# EAGLE design BSK3 (EAGLE 9.4.2)
ESKD_DESCRIPTION1: 207|235|224|242|224|32|193|209|202|51; ESKD_DESCRIPTION2: 241|245|229|236|224|32|253|235|229|234|242|240|232|247|229|241|234|224|255; ESKD_DESCRIPTION3: 239|240|232|237|246|232|239|232|224|235|252|237|224|255; ESKD_NUMBER: 67|67|83|50|46|50|52|48|48|45|48|221|51; ESKD_NUMBER_SHEET: 49; ESKD_SHEETS: 49
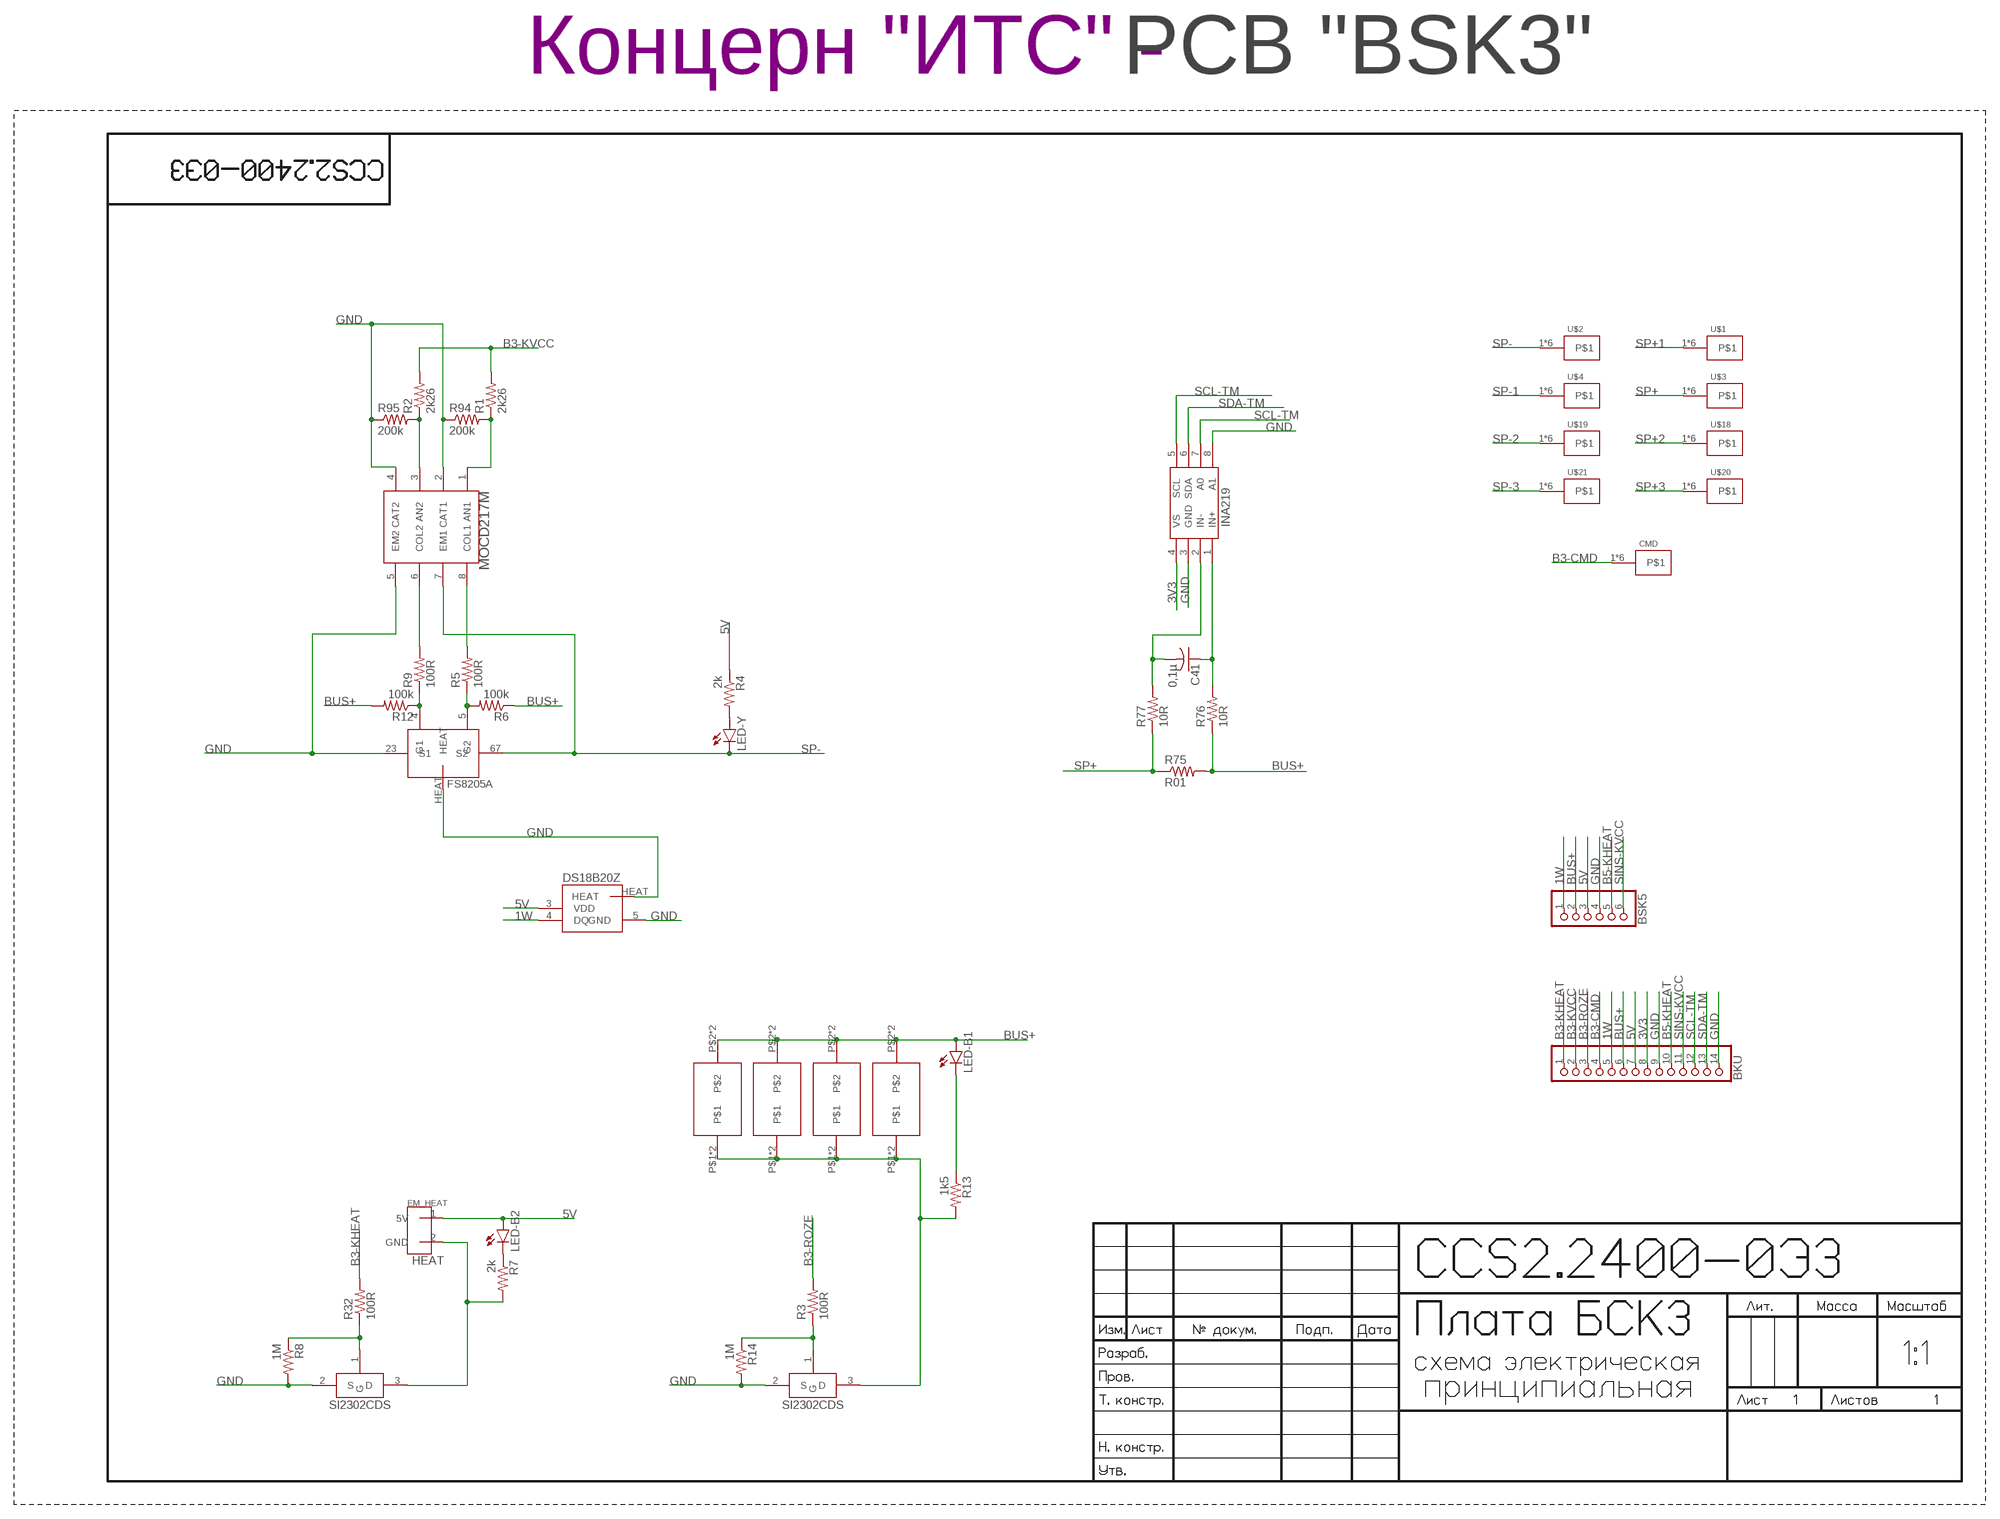
[diagram p0: schematic, sheet 1]

## Parts
BKU  PINHD-1X14  [1X14]
BSK5  PINHD-1X6  [1X06]
C41  0,1µ  C-USC0603  [C0603]
CMD  KCONNECTQUAD  [KCONNECT_QUAD]
DS18B20Z  DS18B20Z  [SOIC8+HEAT_S]
INA  INA219AID  [SOT23-8]
LED-B1  LEDCHIPLED_0603  [CHIPLED_0603]
LED-B2  LEDCHIPLED_0603  [CHIPLED_0603]
LED-Y  LAP4-BOTTOM  [P47F-BOTTOM]
R1  2k26  R-US_R0603  [R0603]
R2  2k26  R-US_R0603  [R0603]
R3  100R  R-US_R0603  [R0603]
R4  2k  R-US_R0603  [R0603]
R5  100R  R-US_R0603  [R0603]
R6  100k  R-US_R0603  [R0603]
R7  2k  R-US_R0603  [R0603]
R8  1M  R-US_R0603  [R0603]
R9  100R  R-US_R0603  [R0603]
R12  100k  R-US_R0603  [R0603]
R13  1k5  R-US_R0603  [R0603]
R14  1M  R-US_R0603  [R0603]
R32  100R  R-US_R0603  [R0603]
R75  R01  R-US_R2512  [R2512]
R76  10R  R-US_R0603  [R0603]
R77  10R  R-US_R0603  [R0603]
R94  200k  R-US_R0603  [R0603]
R95  200k  R-US_R0603  [R0603]
U$1  KCONNECT  [KCONNECT]
U$2  KCONNECT  [KCONNECT]
U$3  KCONNECT  [KCONNECT]
U$4  KCONNECT  [KCONNECT]
U$5  MOCD  MOCD217M  [SOIC8]
U$6  GRAFITGRAFIT4_2  [GRAFIT4_2]
U$7  GRAFITGRAFIT4_2  [GRAFIT4_2]
U$8  SI2302CDS  [SOT23-3]
U$9  PCB "BSK3"  ITS-LOGOPCB-""  [ITS-LOGO]
U$13  SI2302CDS  [SOT23-3]
U$14  EM_HEAT  [EM_HEAT]
U$15  GRAFITGRAFIT4_2  [GRAFIT4_2]
U$16  GRAFITGRAFIT4_2  [GRAFIT4_2]
U$18  KCONNECT  [KCONNECT]
U$19  KCONNECT  [KCONNECT]
U$20  KCONNECT  [KCONNECT]
U$21  KCONNECT  [KCONNECT]
U$26  FS8205A+  [FS8205A+]

## Nets
1: R7.2 U$8.3(D) U$14.2(GND)
1W: BKU.5 BSK5.1 DS18B20Z.4(DQ)
2: R13.2 U$6.P$1 U$6.P$4 U$7.P$1 U$7.P$4 U$13.3(D) U$15.P$1 U$15.P$4 U$16.P$1 U$16.P$4
3V3: BKU.8 INA.4(VS)
5V: BKU.7 BSK5.3 DS18B20Z.3(VDD) LED-B2.A R4.1 U$14.1(5V)
B3-CMD: BKU.4 CMD.1 CMD.2 CMD.3 CMD.4 CMD.P$1 CMD.P$2
B3-KHEAT: BKU.1 R32.2
B3-KVCC: BKU.2 R1.2 R2.2
B3-ROZE: BKU.3 R3.2
B5-KHEAT: BKU.10 BSK5.5
BUS+: BKU.6 BSK5.2 LED-B1.A R6.1 R12.2 R75.2 R76.1 U$6.P$2 U$6.P$5 U$7.P$2 U$7.P$5 U$15.P$2 U$15.P$5 U$16.P$2 U$16.P$5
GND: BKU.9 BKU.14 BSK5.4 DS18B20Z.5(GND) DS18B20Z.HEAT INA.3(GND) INA.8(A1) R8.2 R14.2 R94.1 R95.1 U$5.2(CAT1) U$5.4(CAT2) U$5.5(EM2) U$8.2(S) U$13.2(S) U$26.23(S1) U$26.HEAT
N$1: R5.1 R6.2 U$26.5(G2)
N$2: R1.1 R94.2 U$5.1(AN1)
N$3: R2.1 R95.2 U$5.3(AN2)
N$20: R8.1 R32.1 U$8.1(G)
N$21: R3.1 R14.1 U$13.1(G)
N$27: R9.1 R12.1 U$26.4(G1)
N$28: LED-Y.A R4.2
N$29: LED-B1.C R13.1
N$31: LED-B2.C R7.1
N$150: C41.1 INA.1(IN+) R76.2
N$151: C41.2 INA.2(IN-) R77.2
OC1: R9.2 U$5.6(COL2)
OD1: R5.2 U$5.8(COL1)
SCL-TM: BKU.12 INA.5(SCL) INA.7(A0)
SDA-TM: BKU.13 INA.6(SDA)
SINS-KVCC: BKU.11 BSK5.6
SP+: R75.1 R77.1 U$3.1 U$3.2 U$3.3 U$3.4 U$3.P$1 U$3.P$2
SP+1: U$1.1 U$1.2 U$1.3 U$1.4 U$1.P$1 U$1.P$2
SP+2: U$18.1 U$18.2 U$18.3 U$18.4 U$18.P$1 U$18.P$2
SP+3: U$20.1 U$20.2 U$20.3 U$20.4 U$20.P$1 U$20.P$2
SP-: LED-Y.C U$2.1 U$2.2 U$2.3 U$2.4 U$2.P$1 U$2.P$2 U$5.7(EM1) U$26.67(S2)
SP-1: U$4.1 U$4.2 U$4.3 U$4.4 U$4.P$1 U$4.P$2
SP-2: U$19.1 U$19.2 U$19.3 U$19.4 U$19.P$1 U$19.P$2
SP-3: U$21.1 U$21.2 U$21.3 U$21.4 U$21.P$1 U$21.P$2

## Notes on the sheet
- HEAT

## Library data of the parts
BKU = pinheadCS:PINHD-1X14: PIN HEADER
BSK5 = pinheadCS:PINHD-1X6: PIN HEADER
C41 = rcl:C-US: CAPACITOR, American symbol; SPICEPREFIX: C
CMD U$1-U$4 U$18-U$21 = CanCubeSat:KCONNECT
DS18B20Z = CanCubeSat:DS18B20Z
INA = CanCubeSat:INA219AID
LED-B1 LED-B2 = led:LED: LED OSRAM: - CHIPLED LG R971, LG N971, LY N971, LG Q971, LY Q971, LO R971, LY R971 LH N974, LH R974 LS Q976, LO Q976, LY Q976 LO Q996 - Hyper CHIPLED LW Q18S LB Q993, LB Q99A, LB R99A - SideLED LS A670, LO A670, LY A670, LG A670, LP A670 LB A673, LV A673, LT A673, LW A673 LH A674 LY A675 LS A676, LA A676, LO A676, LY A676, LW A676 LS A679, LY A679, LG A679 - Hyper Micro SIDELED® LS Y876, LA Y876, LO Y876, LY Y876 LT Y87S - SmartLED LW L88C, LW L88S LB L89C, LB L89S, LG L890 LS L89K, LO L89K, LY L89K LS L896, LA L896, LO L896, LY L896 - TOPLED LS T670, LO T670, LY T670, LG T670, LP T670 LSG T670, LSP T670, LSY T670, LOP T670, LYG T670 LG T671, LOG T671, LSG T671 LB T673, LV T673, LT T673, LW T673 LH T674 LS T676, LA T676, LO T676, LY T676, LB T676, LH T676, LSB T676, LW T676 LB T67C, LV T67C, LT T67C, LS T67K, LO T67K, LY T67K, LW E67C LS E67B, LA E67B, LO E67B, LY E67B, LB E67C, LV E67C, LT E67C LW T67C LS T679, LY T679, LG T679 LS T770, LO T770, LY T770, LG T770, LP T770 LB T773, LV T773, LT T773, LW T773 LH T774 LS E675, LA E675, LY E675, LS T675 LS T776, LA T776, LO T776, LY T776, LB T776 LHGB T686 LT T68C, LB T68C - Hyper Mini TOPLED® LB M676 - Mini TOPLED Santana® LG M470 LS M47K, LO M47K, LY M47K Source: http://www.osram.convergy.de LUXEON: - LUMILED® LXK2-PW12-R00, LXK2-PW12-S00, LXK2-PW14-U00, LXK2-PW14-V00 LXK2-PM12-R00, LXK2-PM12-S00, LXK2-PM14-U00 LXK2-PE12-Q00, LXK2-PE12-R00, LXK2-PE12-S00, LXK2-PE14-T00, LXK2-PE14-U00 LXK2-PB12-K00, LXK2-PB12-L00, LXK2-PB12-M00, LXK2-PB14-N00, LXK2-PB14-P00, LXK2-PB14-Q00 LXK2-PR12-L00, LXK2-PR12-M00, LXK2-PR14-Q00, LXK2-PR14-R00 LXK2-PD12-Q00, LXK2-PD12-R00, LXK2-PD12-S00 LXK2-PH12-R00, LXK2-PH12-S00 LXK2-PL12-P00, LXK2-PL12-Q00, LXK2-PL12-R00 Source: www.luxeon.com KINGBRIGHT: KA-3528ASYC Source: www.kingbright.com
LED-Y = led:*P4: PointLED® Enhanced Thinfilm LED TOP & BOTTOM mount LS P47F, LR P47F, LA P47F, LY P47F, LT P4SG, LB P4SG, LW P4SG Source: http://catalog.osram-os.com .. LA_LR_LS_LY_P47F_Pb_free.pdf
R1-R9 R12-R14 R32 R76 R77 R94 R95 = resistor:R-US_: RESISTOR, American symbol
R75 = rcl:R-US_: RESISTOR, American symbol; SPICEPREFIX: R
U$5 = CanCubeSat:MOCD217M
U$6 U$7 U$15 U$16 = CanCubeSat:GRAFIT
U$8 U$13 = CanCubeSat:SI2302CDS
U$9 = CanCubeSat:ITS-LOGO
U$14 = CanCubeSat:EM_HEAT
U$26 = CanCubeSat:FS8205A+

## Board
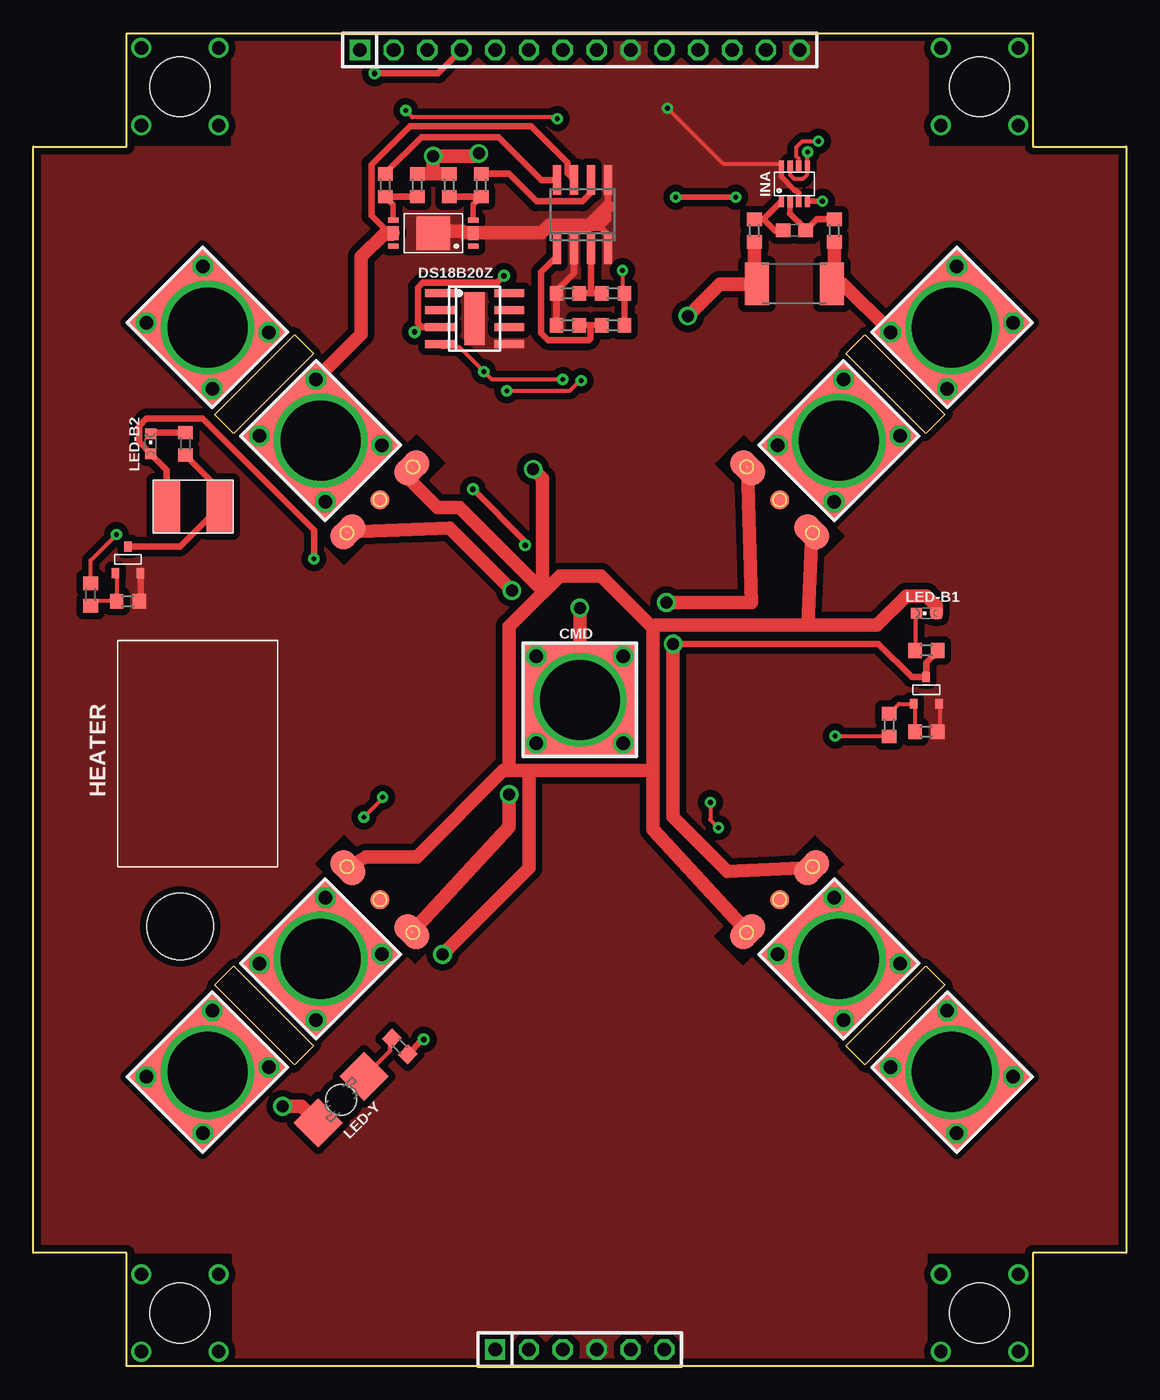
[diagram p1: board, top side]
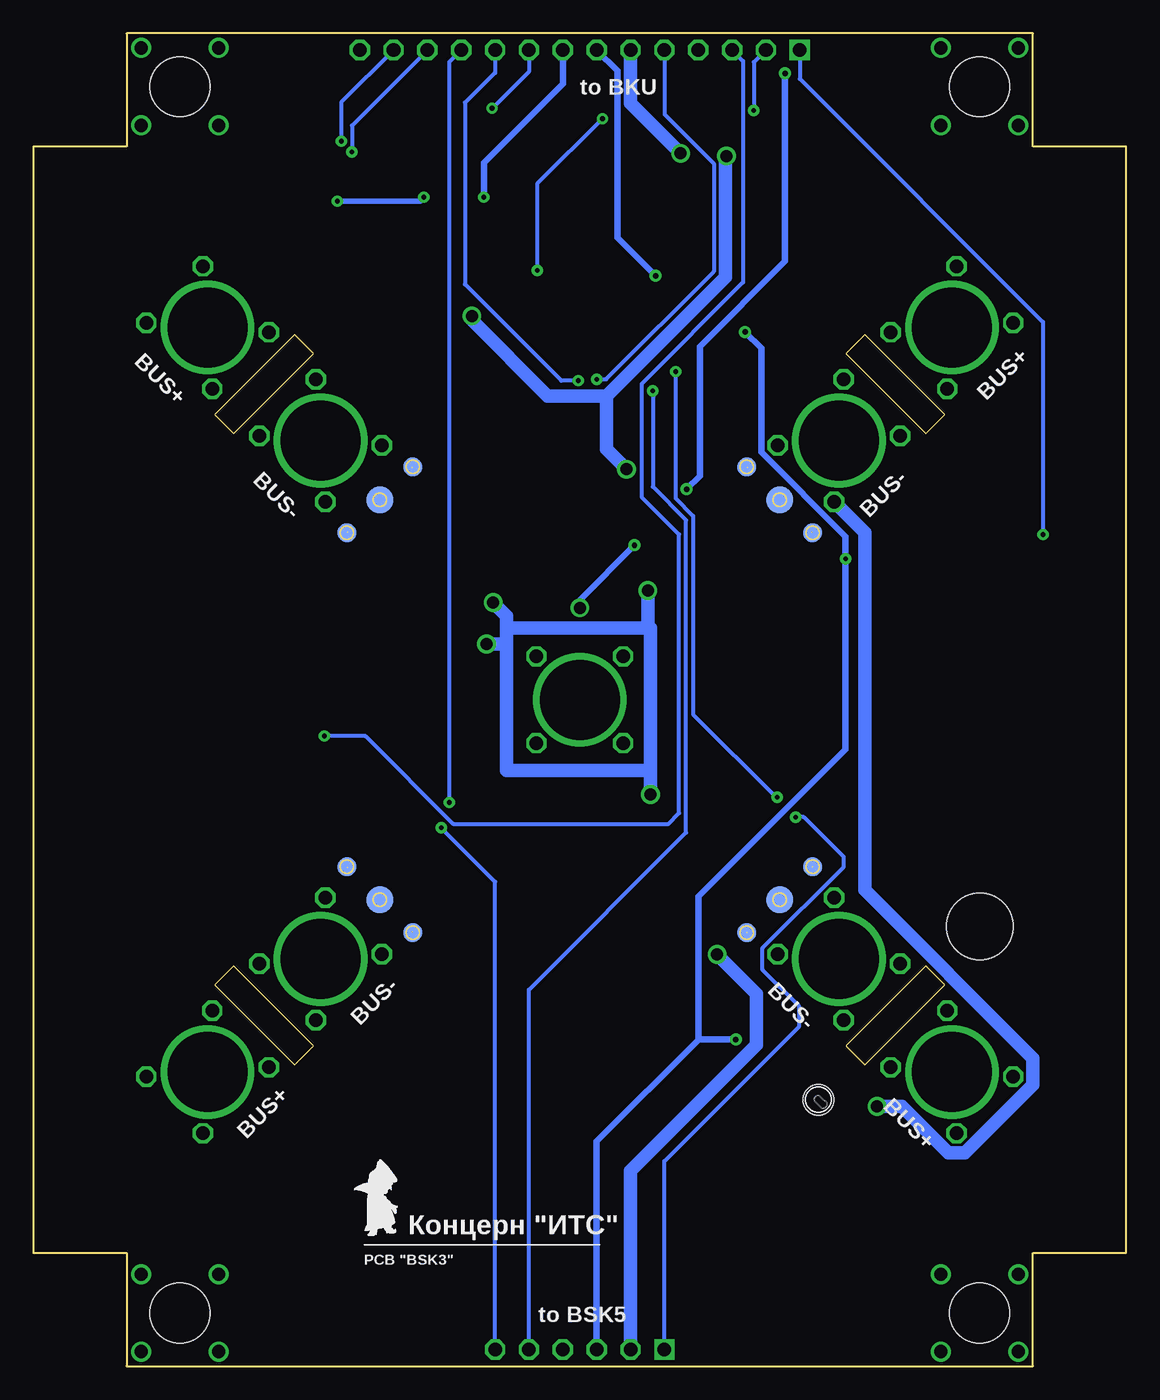
[diagram p2: board, bottom side, seen from below]

Size 82 x 100 mm. Coordinates in mm from the lower left corner, seen from the top.
Outline: 0,8.5 0,91.5 7,91.5 7,100 75,100 75,91.5 82,91.5 82,8.5 75,8.5 75,0 7,0 7,8.5 0,8.5
Outline: 60.98,24.01 66.99,30.02 68.4,28.61 62.39,22.6 60.98,24.01
Outline: 13.6,71.39 19.61,77.4 21.02,75.99 15.01,69.98 13.6,71.39
Outline: 66.99,69.98 60.98,75.99 62.39,77.4 68.4,71.39 66.99,69.98
Outline: 19.61,22.6 13.6,28.61 15.01,30.02 21.02,24.01 19.61,22.6
Copper layers (1*16): Top 0.035mm / dielectric 1.5mm / Bottom 0.035mm
Design rules "default *": minimum track width 0.3mm, minimum drill 0.35mm, track to track 0.22mm, track to pad 0.22mm, pad to pad 0.22mm, via to via 0.22mm, smd to smd 0.22mm, copper to edge 0.25mm, drill to drill 8mil, minimum pad ring 0.25mm, minimum via ring 0.25mm, stop-mask expansion 2mil, vias tented up to drill 0mil, thermal gap 10mil
Holes 4.5 mm at 11,4 71,4 71,96 11,96
Holes 5 mm at 11,33

### Footprints (pad centres in the part's own frame; a part is rotated, then mirrored left to right if it is on the bottom)
1X14 = drill 1.016 square: 1 -16.51,0 | drill 1.016 octagon: 2 -13.97,0; 3 -11.43,0; 4 -8.89,0; 5 -6.35,0; 6 -3.81,0; 7 -1.27,0; 8 1.27,0; 9 3.81,0; 10 6.35,0; 11 8.89,0; 12 11.43,0; 13 13.97,0; 14 16.51,0
1X06 = drill 1.016 square: 1 -6.35,0 | drill 1.016 octagon: 2 -3.81,0; 3 -1.27,0; 4 1.27,0; 5 3.81,0; 6 6.35,0
C0603 = smd 1.1 x 1: 1 -0.85,0; 2 0.85,0
KCONNECT_QUAD = drill 1.016 octagon: 1 -3.25,-3.25; 2 -3.25,3.25; 3 3.25,-3.25; 4 3.25,3.25 | drill 6: P$1 0,0 | smd 8.5 x 8.5: P$2 0,0
SOIC8+HEAT_S = smd 0.6 x 2.2: 1 -1.905,-2.6; 2 -0.635,-2.6; 3 0.635,-2.6; 4 1.905,-2.6; 5 1.905,2.6; 6 0.635,2.6; 7 -0.635,2.6; 8 -1.905,2.6 | smd 4 x 1.5: HEAT 0,0
SOT23-8 = smd 0.9 x 0.4: 1 -1.3,0.975; 2 -1.3,0.325; 3 -1.3,-0.325; 4 -1.3,-0.975; 5 1.3,-0.975; 6 1.3,-0.325; 7 1.3,0.325; 8 1.3,0.975
CHIPLED_0603 = smd 0.8 x 0.8: A 0,-0.75; C 0,0.75
P47F-BOTTOM = smd 2.6 x 2.6: A -2.45,0; C 2.45,0 | hole 2.3: 0,0
R0603 = smd 1 x 1.1: 1 -0.85,0; 2 0.85,0
R2512 = smd 1.8 x 3.2: 1 -2.8,0; 2 2.8,0
KCONNECT = drill 1.016 octagon: 1 -3,-3.5; 2 -3,3.5; 3 3,-3.5; 4 3,3.5 | drill 6: P$1 0,0 | smd 8 x 9: P$2 0,0
SOIC8 = smd 0.6 x 2.2: 1 -1.905,-2.6; 2 -0.635,-2.6; 3 0.635,-2.6; 4 1.905,-2.6; 5 1.905,2.6; 6 0.635,2.6; 7 -0.635,2.6; 8 -1.905,2.6
GRAFIT4_2 = smd 2 x 2 bottom: OUT 0,0 | smd 2 x 2.9: P$1 0,3.4; P$2 0,-3.4 | smd 1.4 x 1.4: P$3 0,0 | smd 1.4 x 1.4 bottom: P$4 0,3.5; P$5 0,-3.5
SOT23-3 = smd 0.56 x 0.73: 1 -0.95,-1; 2 0.95,-1; 3 0,1
EM_HEAT = smd 2 x 4: 1 -2,0; 2 2,0
FS8205A+ = smd 0.4 x 0.8: 1 -0.975,-3; 4 0.975,-3; 5 0.975,3; 8 -0.975,3 | smd 1.05 x 0.8: 23 0,-3; 67 0,3 | smd 2.5 x 2.5: HEAT 0,0

### Placement (x,y rotation side)
BKU  41,98.75 0 top
BSK5  41,1.25 0 top
C41  57.1,85.2 0 top
CMD  41,50 0 top
DS18B20Z  33.1,78.6 270 top
INA  57.1,88.7 90 top
LED-B1  67,56.5 90 top
LED-B2  8.8,69.2 0 top
LED-Y  23.1,20 225 top
R1  43.5,78.1 0 top
R2  43.5,80.5 0 top
R3  64.2,48.1 270 top
R4  27.5,24 135 top
R5  26.4,88.6 90 top
R6  28.8,88.6 270 top
R7  11.4,69.2 270 top
R8  7.1,57.4 0 top
R9  33.6,88.6 90 top
R12  31.2,88.6 90 top
R13  67,53.7 0 top
R14  67,47.6 0 top
R32  4.3,57.9 90 top
R75  57.1,81.2 180 top
R76  54.1,85.2 90 top
R77  60.1,85.2 90 top
R94  40.1,78.1 0 top
R95  40.1,80.5 0 top
U$1  13.07,77.93 45 top
U$2  21.55,69.44 45 top
U$3  68.93,77.93 315 top
U$4  60.45,69.44 315 top
U$5  41.2,86.4 0 top
U$6  26,65 135 top
U$7  26,35 225 top
U$8  7.1,60.5 0 top
U$9  57.2,9.1 0 bottom
U$13  67,50.7 0 top
U$14  12,64.5 0 top
U$15  56,65 45 top
U$16  56,35 315 top
U$18  13.07,22.07 135 top
U$19  21.55,30.55 135 top
U$20  68.93,22.07 225 top
U$21  60.45,30.55 225 top
U$26  30,85 90 top

### Tracks (layer width: path | path; a pad name or v marks a point on that pad's centre or on a via)
1
  Top 0.5: U$8.3 11,61.5 U$14.2 14,65.75 R7.2
1W  (via drill 0.35)
  Top 0.3: v39.72,74.04 39.7,74.02 34.4,74.02 v33.8,74.62 31.98,76.44 30.68,76.44 DS18B20Z.4 | v24.8,41.2 26.2,42.6 v26.2,42.7
  Bottom 0.3: v39.72,74.04 39.02,74.04 30.94,82.12 30.94,90.22 34.64,93.92 BKU.5 | v24.8,41.2 24.2,41.2 21.2,38.2 21.2,37.46 27.28,31.38 27.28,29.74 24.53,26.99 24.53,25.5 34.65,15.38 BSK5.1 | v26.2,42.7 26.3,42.7 32.5,48.9 32.5,63.8 33.8,65.1 v33.8,74.62
2  (via drill 0.9)  (4 unrouted)
  Top 0.3: R13.2 67.78,53.56
  Top 0.5: 67.78,53.56 67,52.78 U$13.3 65.9,51.7 63.4,54.2 48,54.2
  Top 1: U$7.P$1 35.7,40.46 v35.7,42.9 | U$15.P$1 53.88,57.3 v47.5,57.3 | U$16.P$1 52.08,37.12 48,41.2 v48,54.18 48,54.2 | U$6.P$1 31.22,62.88 v35.9,58.2
  Bottom 1: v35.7,42.9 35.7,44.8 | 35.7,44.8 35.7,55.4 | 35.7,55.4 46.5,55.4 | 46.5,55.4 46.5,54.2 | 46.5,54.2 46.5,44.7 35.8,44.7 35.7,44.8 | v47.5,57.3 46.5,56.3 46.5,55.4 | v48,54.18 46.52,54.18 46.5,54.2 | v35.9,58.2 35.9,55.6 35.7,55.4
3V3  (via drill 0.35)
  Top 0.4: INA.4 v59.2,87.4 | v52.7,87.7 v48.19,87.7
  Bottom 0.4: v59.2,87.4 53,87.4 v52.7,87.7
  Bottom 0.5: v48.19,87.7 48.19,90.29 42.27,96.21 BKU.8
5V  (via drill 0.35, 0.4)
  Top 0.5: U$14.1 10,67.25 LED-B2.A 8.8,68.48 7.93,69.36 7.93,70.55 8.48,71.1 12.7,71.1 21.06,62.74 v21.06,60.58 | DS18B20Z.3 29.16,77.97 | 29.16,77.97 28.86,78.26 28.86,80.93 29.2,81.28 34.77,81.28 v35.31,81.81 | 29.16,77.97 28.96,77.97 v28.6,77.6 | R4.1 29.2,24.5 v29.3,24.5
  Bottom 0.5: v28.6,77.6 27.38,76.38 27.38,68.58 21.06,62.26 v21.06,60.58 21.06,46.28 32.11,35.23 32.11,24.5 | v29.3,24.5 32.11,24.5 | BKU.7 38.16,97.18 38.16,84.66 v35.31,81.81 | BSK5.3 39.73,16.88 32.11,24.5
B3-CMD  (via drill 0.4, 0.9)
  Top 0.3: 41.08,49.92 38.22,47.06 CMD.1 | CMD.2 CMD.P$2 41.08,49.92 | 41.08,49.92 CMD.3 | 41.08,49.92 43.94,52.78 CMD.4
  Top 0.5: v32.98,65.8 36.9,61.88 v36.9,61.6 | BKU.4 30.36,97 v25.6,97
  Top 1: CMD.P$2 v41,56.9
  Bottom 0.5: v25.6,97 25.6,82.9 32,76.5 32,66.78 v32.98,65.8 | v36.9,61.6 41,57.5 v41,56.9
B3-KHEAT  (via drill 0.35)
  Top 0.3: R32.2 4.3,60.46 v6.24,62.4
  Bottom 0.3: v6.24,62.4 6.24,78.34 24.49,96.59 BKU.1
B3-KVCC  (via drill 0.35)
  Top 0.3: v44.2,82.2 44.2,80.6 R2.2 | v27.95,94.2 28.45,93.7 39.2,93.7 v39.3,93.6
  Top 0.5: R2.2 R1.2
  Bottom 0.3: v39.3,93.6 44.2,88.7 v44.2,82.2 | BKU.2 27.95,97.83 v27.95,94.2
B3-ROZE  (via drill 0.35)
  Top 0.3: R3.2 60.2,47.25 v60.16,47.28
  Bottom 0.3: v60.16,47.28 57.08,47.28 50.5,40.7 34.34,40.7 33.54,41.5 33.54,62.4 36.36,65.22 36.36,73.7 28.74,81.32 28.74,97.92 BKU.3
B5-KHEAT  (via drill 0.35)
  Top 0.3: v35.52,73.18 40.26,73.18 41.02,73.94 v41.12,73.94
  Bottom 0.3: v35.52,73.18 35.52,65.98 33.02,63.48 33.02,40.04 44.81,28.25 BSK5.5 | v41.12,73.94 42.38,73.94 49.62,81.18 49.62,94.8 47.37,97.05 47.35,97.04 BKU.10
BUS+  (via drill 0.9)  (4 unrouted)
  Top 1: R76.1 54.1,81.4 R75.2 51.5,81.2 v49.1,78.8 | R6.1 29.9,89.45 | 29.9,89.45 R12.2 | 29.9,89.45 30,89.55 v30,90.8 33.23,90.8 v33.43,91 | U$7.P$2 24.98,38.22 28.78,38.22 35.26,44.7 37.2,44.7 | 46.5,55.4 46.5,44.7 | 46.5,44.7 37.2,44.7 | 35.7,44.7 35.7,55.5 38.2,58 | LED-B1.A 67.75,57.05 67,57.8 65.5,57.8 63.3,55.6 58.12,55.6 | v30.7,30.9 37.2,37.4 37.2,44.7 | 58.12,55.6 U$15.P$2 | U$16.P$2 46.5,40.26 46.5,44.7 | U$6.P$2 28.12,66.62 30.32,64.42 31.98,64.42 38.3,58.1 | v37.5,67.3 38.2,66.6 38.2,58 | 38.2,58 38.3,58.1 | 38.3,58.1 39.5,59.3 42.6,59.3 46.5,55.4 | 46.5,55.4 46.72,55.62 46.74,55.6 58.12,55.6
  Bottom 1: v30,90.8 30.07,90.73 30.07,81.72 38.99,72.8 | 38.99,72.8 43.41,72.8 49.1,78.48 v49.1,78.8 | v30.7,30.9 27.73,27.93 27.73,24.12 37.19,14.66 BSK5.2 | 38.99,72.8 38.99,68.8 v37.5,67.3 | BKU.6 37.19,94.76 v33.43,91
GND  (via drill 0.35)
  Top 0.3: U$26.HEAT 30.16,85.02 32.76,85.02 U$26.23 33.28,85.28 40.56,85.28 40.72,85.12 | v47.58,94.38 51.74,90.22 56.16,90.22 INA.8 | U$13.2 68.04,49.66 68.04,47.84 R14.2 | 8.06,57.2 R8.2 | 34.84,76.7 35.62,76.7 DS18B20Z.5 34.84,76.7
  Top 0.4: INA.8 56.12,89.23 57.11,88.25 57.17,88.25 57.42,88 INA.3
  Top 0.5: R8.2 8.05,57.5 U$8.2 | R94.1 R95.1 39.25,80.7 40.56,82.02 U$5.2 40.56,84.97 40.72,85.12 41,85.4 42.5,85.4 | 42.5,85.4 42.6,85.4 43.1,84.89 U$5.4 | U$5.5 43.1,87 43.1,86 42.5,85.4
  Top 1: U$26.HEAT 30.15,85.15 32.21,85.15 32.3,85.06 38.13,85.06 38.7,85.62 41.73,85.62 43.1,87
  Bottom 0.3: v47.58,94.38 47.54,94.38 44.81,97.11 BKU.9
  cutout Top: 13.05,71.45 15.05,69.45 21.55,75.95 19.55,77.95
  pour Top (isolate 0.5, no thermals): 0,91.5 14.9,91.5 14.9,100 67.1,100 67.1,91.5 82,91.5 82,8.5 67,8.5 67,0 15,0 15,8.4 14.9,8.5 0,8.5
GND1
  cutout Top (no thermals): 60.75,37.65 53.25,30.15 51.15,32.25 58.65,39.75
GND2
  cutout Top (no thermals): 58.7,60.2 51.2,67.7 53.3,69.8 60.8,62.3
GND3
  cutout Top (no thermals): 28.65,30.25 21.2,37.7 23.3,39.8 30.75,32.35
GND4
  cutout Top (no thermals): 30.85,67.75 23.3,60.2 21.2,62.3 28.75,69.85
HEAT1
  cutout Top: 60.45,24.05 62.45,22.05 68.95,28.55 66.95,30.55
HEAT2
  cutout Top: 66.95,69.45 68.95,71.45 62.45,77.95 60.45,75.95
HEAT3
  cutout Top: 19.55,22.05 21.55,24.05 15.05,30.55 13.05,28.55
N$1
  Top 0.4: R5.1 27,87.15 U$26.5
  Top 0.5: R6.2 R5.1
N$2
  Top 0.5: U$5.1 39.3,83.3 38.1,82.1 38.1,77.5 38.6,77 41.7,77 41.8,77.1 41.8,78.1 | 41.8,78.1 R94.2 | 41.8,78.1 R1.1
N$3
  Top 0.5: R95.2 41.8,80.5 | 41.8,80.5 R2.1 | U$5.3 41.84,80.53 41.8,80.5
N$4  (via drill 1)
  other vias: 68.1,6.9
N$5  (via drill 1)
  other vias: 68.1,1.1
N$6  (via drill 1)
  other vias: 73.9,1.1
N$7  (via drill 1)
  other vias: 73.9,6.9
N$8  (via drill 1)
  other vias: 8.1,98.9
N$9  (via drill 1)
  other vias: 8.1,93.1
N$10  (via drill 1)
  other vias: 13.9,93.1
N$11  (via drill 1)
  other vias: 8.1,6.9
N$12  (via drill 1)
  other vias: 8.1,1.1
N$13  (via drill 1)
  other vias: 13.9,1.1
N$14  (via drill 1)
  other vias: 13.9,6.9
N$15  (via drill 1)
  other vias: 13.9,98.9
N$16  (via drill 1)
  other vias: 68.1,98.9
N$17  (via drill 1)
  other vias: 68.1,93.1
N$18  (via drill 1)
  other vias: 73.9,93.1
N$19  (via drill 1)
  other vias: 73.9,98.9
N$20
  Top 0.3: U$8.1 6.25,59.4 R8.1 4.65,57.4 R32.1
N$21
  Top 0.3: R14.1 66.15,49.6 U$13.1 64.95,49.7 R3.1
N$27
  Top 0.4: R9.1 33,87.15 U$26.4
  Top 0.5: R9.1 R12.1
N$28
  Top 0.3: R4.2 26.78,24.44 26.78,23.66 24.96,21.84 LED-Y.A
N$29
  Top 0.3: LED-B1.C 66.22,56.42 66.22,53.82 R13.1
N$31
  Top 0.5: R7.1 8.9,70.05 LED-B2.C
N$150
  Top 0.4: INA.1 54.77,86.05
  Top 0.5: R76.2 54.77,86.05 55.62,85.2 C41.1
N$151
  Top 0.4: INA.2 56.77,86.47
  Top 0.5: 56.77,86.47 57.95,85.3 C41.2 58.8,86.05 R77.2
OC1
  Top 0.5: U$5.6 41.84,88.03 41.2,87.4 37.75,87.4 35.7,89.45 R9.2
OD1
  Top 0.5: R5.2 26.4,89.49 29.13,92.22 34.91,92.22 38.14,89 U$5.8
SCL-TM  (via drill 0.35)
  Top 0.3: INA.7 56.77,89.41 57.08,89.1 57.77,89.1 58.08,89.41 INA.5 58.08,91.08 v58.1,91.1
  Bottom 0.3: BKU.12 58.1,93.08 v58.1,91.1
SDA-TM  (via drill 0.35)
  Top 0.3: INA.6 57.42,90.6 57.23,90.8 57.23,91.42 57.7,91.9 v58.9,91.9
  Bottom 0.3: BKU.13 58.9,94.82 v58.9,91.9
SINS-KVCC  (via drill 0.35)
  Top 0.3: v50.8,42.3 50.8,41 v51.4,40.4
  Bottom 0.3: BKU.11 50.8,97.84 v50.8,42.3 | BSK5.6 47.35,36.35 v51.4,40.4
SP+
  Top 0.3: 68.64,77.74 68.9,77.74 U$3.P$2 | 68.64,77.74 64.48,77.74 U$3.1 64.22,77.74 | 68.64,77.74 68.64,73.58 U$3.3 | 68.64,77.74 U$3.P$2 | 69.42,78.26 73.32,78.26 U$3.4 | 69.42,78.26 69.16,78 U$3.P$2 | 69.42,78.26 69.42,82.42 U$3.2 | 69.42,78.26 U$3.P$2
  Top 1: R77.1 60.1,81.4 R75.1 60.76,81.2 64.22,77.74
SP+1
  Top 0.3: 12.74,78.26 8.58,78.26 U$1.2 | 13.26,77.48 13.26,77.74 U$1.P$2 | 13.26,77.48 13.26,73.58 U$1.1 | 13.26,77.48 17.42,77.48 U$1.3 | 13.26,77.48 U$1.P$2 | 12.74,78.26 12.74,82.42 U$1.4 | 12.74,78.26 13,78 U$1.P$2
SP+2
  Top 0.3: 12.74,21.58 12.74,17.68 U$18.2 | 12.74,21.58 13,21.84 U$18.P$2 | 12.74,21.58 8.58,21.58 U$18.4 | 12.74,21.58 U$18.P$2 | 13.52,22.36 17.42,22.36 U$18.1 | 13.52,22.36 13.26,22.1 U$18.P$2 | 13.52,22.36 13.52,26.52 U$18.3 | 13.52,22.36 U$18.P$2
SP+3
  Top 0.3: 69.16,21.84 69.16,17.68 U$20.4 | 69.16,21.84 73.32,21.84 U$20.2 | 69.16,21.84 U$20.P$2 68.9,22.1 68.64,22.36 | 68.64,22.36 64.48,22.36 U$20.3 | 68.64,22.36 68.64,26.52 U$20.1
SP-  (via drill 0.9)
  Top 0.3: U$2.2 17.16,69.68 21.32,69.68 U$2.P$2 | U$2.4 21.32,74.1 U$2.P$2 | 22.1,69.16 21.84,69.16 U$2.P$2 | 22.1,69.16 26,69.16 U$2.3 | 22.1,69.16 22.1,65 U$2.1 | 22.1,69.16 U$2.P$2
  Top 0.5: U$5.7 40.06,89.5 40.06,90.3 37.34,93.02 28.25,93.02 25.38,90.14 25.38,86.33 26.41,85.31 26.59,85.31 26.95,84.94
  Top 1: U$26.67 26.95,84.94 26.3,84.94 24.6,83.24 24.6,77.44 U$2.4 | LED-Y.C 20.14,19.5 v18.7,19.5
  Bottom 1: v18.7,19.5 16.84,19.5 13.33,15.99 12.1,15.99 6.99,21.1 6.99,23.1 19.62,35.73 19.62,62.56 U$2.1
SP-1
  Top 0.3: 60.06,69.16 55.9,69.16 U$4.1 | 60.06,69.16 60.32,69.42 U$4.P$2 | 60.06,69.16 60.06,65 U$4.3 | 60.06,69.16 U$4.P$2 | 60.84,69.68 60.58,69.68 U$4.P$2 | 60.84,69.68 65,69.68 U$4.4 | 60.84,69.68 60.84,73.84 U$4.2 | 60.84,69.68 U$4.P$2
SP-2
  Top 0.3: 21.32,30.16 21.32,30.42 U$19.P$2 | 21.32,30.16 21.32,26 U$19.2 | 21.32,30.16 17.16,30.16 U$19.4 | 21.32,30.16 U$19.P$2 | 21.84,30.94 21.84,35.1 U$19.3 | 21.84,30.94 21.58,30.68 U$19.P$2 | 21.84,30.94 26,30.94 U$19.1 | 21.84,30.94 U$19.P$2
SP-3
  Top 0.3: 60.58,30.16 60.58,30.42 U$21.P$2 | 60.58,30.16 60.58,26 U$21.4 | 60.58,30.16 65,30.16 U$21.2 | 60.58,30.16 U$21.P$2 | 60.32,30.68 55.9,30.68 U$21.3 | 60.32,30.68 60.32,35.1 U$21.1 | 60.32,30.68 U$21.P$2

### Text on the board
tPlace: HEATER
bNames: to BKU | BUS+ | BUS+ | BUS- | BUS- | BUS- | BUS- | BUS+ | BUS+ | to BSK5